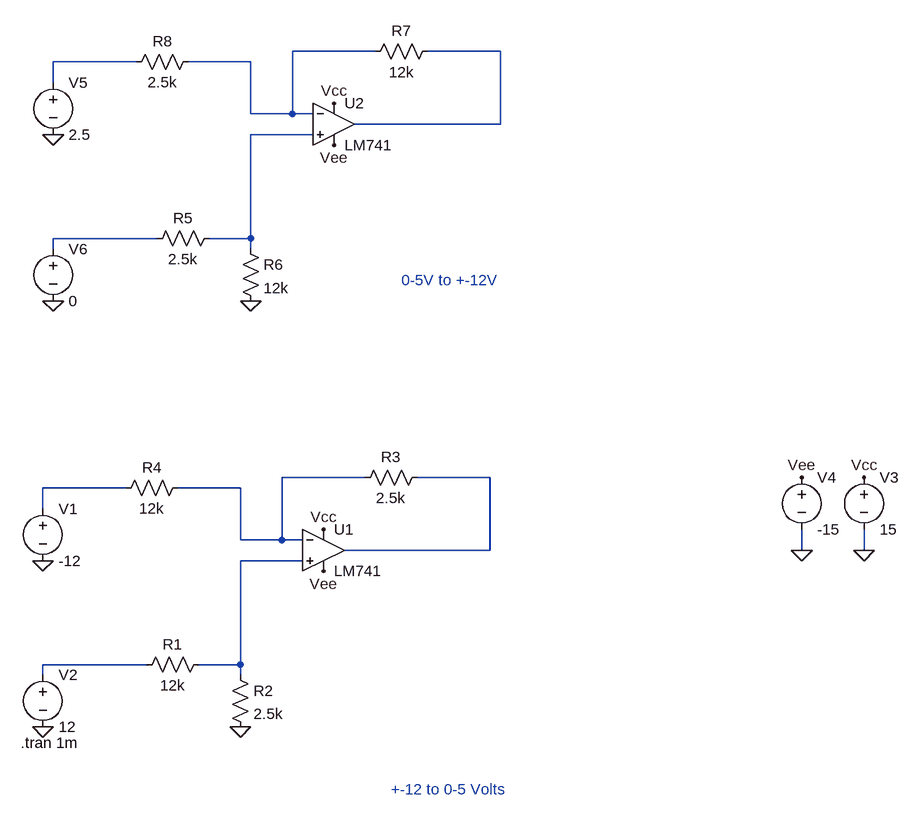
[diagram p0: schematic Scaler-Descaler.asc]
Scaler-Descaler.asc, the LTspice schematic file:
Version 4
SHEET 1 1372 680
WIRE 560 -624 432 -624
WIRE 752 -624 640 -624
WIRE 192 -608 64 -608
WIRE 368 -608 272 -608
WIRE 64 -576 64 -608
WIRE 368 -528 368 -608
WIRE 432 -528 432 -624
WIRE 432 -528 368 -528
WIRE 464 -528 432 -528
WIRE 752 -512 752 -624
WIRE 752 -512 528 -512
WIRE 464 -496 368 -496
WIRE 224 -336 64 -336
WIRE 368 -336 368 -496
WIRE 368 -336 304 -336
WIRE 64 -320 64 -336
WIRE 368 -320 368 -336
WIRE 544 32 416 32
WIRE 736 32 624 32
WIRE 176 48 48 48
WIRE 352 48 256 48
WIRE 48 80 48 48
WIRE 352 128 352 48
WIRE 416 128 416 32
WIRE 416 128 352 128
WIRE 448 128 416 128
WIRE 736 144 736 32
WIRE 736 144 512 144
WIRE 1216 144 1216 112
WIRE 1312 144 1312 112
WIRE 448 160 352 160
WIRE 208 320 48 320
WIRE 352 320 352 160
WIRE 352 320 288 320
WIRE 48 336 48 320
WIRE 352 336 352 320
FLAG 352 416 0
FLAG 48 416 0
FLAG 48 160 0
FLAG 1312 144 0
FLAG 1312 32 Vcc
FLAG 1216 144 0
FLAG 1216 32 Vee
FLAG 480 176 Vee
FLAG 480 112 Vcc
FLAG 368 -240 0
FLAG 64 -240 0
FLAG 64 -496 0
FLAG 496 -480 Vee
FLAG 496 -544 Vcc
SYMBOL voltage 48 64 R0
WINDOW 123 0 0 Left 2
WINDOW 39 0 0 Left 2
SYMATTR InstName V1
SYMATTR Value -12
SYMBOL voltage 48 320 R0
WINDOW 123 0 0 Left 2
WINDOW 39 0 0 Left 2
SYMATTR InstName V2
SYMATTR Value 12
SYMBOL LM741 480 80 R0
SYMATTR InstName U1
SYMBOL res 304 304 R90
WINDOW 0 0 56 VBottom 2
WINDOW 3 32 56 VTop 2
SYMATTR InstName R1
SYMATTR Value 12k
SYMBOL res 336 320 R0
SYMATTR InstName R2
SYMATTR Value 2.5k
SYMBOL res 640 16 R90
WINDOW 0 0 56 VBottom 2
WINDOW 3 32 56 VTop 2
SYMATTR InstName R3
SYMATTR Value 2.5k
SYMBOL res 272 32 R90
WINDOW 0 0 56 VBottom 2
WINDOW 3 32 56 VTop 2
SYMATTR InstName R4
SYMATTR Value 12k
SYMBOL voltage 1312 16 R0
WINDOW 123 0 0 Left 2
WINDOW 39 0 0 Left 2
SYMATTR InstName V3
SYMATTR Value 15
SYMBOL voltage 1216 16 R0
WINDOW 123 0 0 Left 2
WINDOW 39 0 0 Left 2
SYMATTR InstName V4
SYMATTR Value -15
SYMBOL voltage 64 -592 R0
WINDOW 123 0 0 Left 2
WINDOW 39 0 0 Left 2
SYMATTR InstName V5
SYMATTR Value 2.5
SYMBOL voltage 64 -336 R0
WINDOW 123 0 0 Left 2
WINDOW 39 0 0 Left 2
SYMATTR InstName V6
SYMATTR Value 0
SYMBOL LM741 496 -576 R0
SYMATTR InstName U2
SYMBOL res 320 -352 R90
WINDOW 0 0 56 VBottom 2
WINDOW 3 32 56 VTop 2
SYMATTR InstName R5
SYMATTR Value 2.5k
SYMBOL res 352 -336 R0
SYMATTR InstName R6
SYMATTR Value 12k
SYMBOL res 656 -640 R90
WINDOW 0 0 56 VBottom 2
WINDOW 3 32 56 VTop 2
SYMATTR InstName R7
SYMATTR Value 12k
SYMBOL res 288 -624 R90
WINDOW 0 0 56 VBottom 2
WINDOW 3 32 56 VTop 2
SYMATTR InstName R8
SYMATTR Value 2.5k
TEXT 14 440 Left 2 !.tran 1m
TEXT 584 512 Left 2 ;+-12 to 0-5 Volts
TEXT 600 -272 Left 2 ;0-5V to +-12V

The netlist it stands for:
* Scaler-Descaler.asc
V1 N008 0 -12
V2 N010 0 12
XU1 N009 N006 Vcc Vee N007 LM741  ; pins In+ In- V+ V- OUT
R1 N009 N010 12k
R2 N009 0 2.5k
R3 N007 N006 2.5k
R4 N006 N008 12k
V3 Vcc 0 15
V4 Vee 0 -15
V5 N003 0 2.5
V6 N005 0 0
XU2 N004 N001 Vcc Vee N002 LM741  ; pins In+ In- V+ V- OUT
R5 N004 N005 2.5k
R6 N004 0 12k
R7 N002 N001 12k
R8 N001 N003 2.5k
.tran 1m
* +-12 to 0-5 Volts
* 0-5V to +-12V
.lib LM741.lib
.backanno
.end